# EAGLE schematic BlankMSXCartHSH (EAGLE 7.5.0)
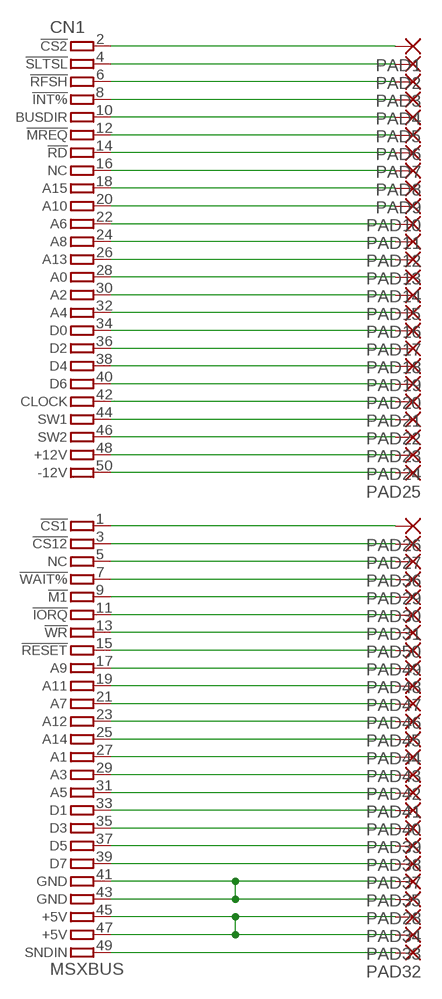
[diagram p0: schematic, sheet 1]

## Parts
CN1  MSXBUS  MSXBUS_EDGE  [MSXBUS_EDGECONN]
PAD1  1,6/0,8  [1,6/0,8]
PAD2  1,6/0,8  [1,6/0,8]
PAD3  1,6/0,8  [1,6/0,8]
PAD4  1,6/0,8  [1,6/0,8]
PAD5  1,6/0,8  [1,6/0,8]
PAD6  1,6/0,8  [1,6/0,8]
PAD7  1,6/0,8  [1,6/0,8]
PAD8  1,6/0,8  [1,6/0,8]
PAD9  1,6/0,8  [1,6/0,8]
PAD10  1,6/0,8  [1,6/0,8]
PAD11  1,6/0,8  [1,6/0,8]
PAD12  1,6/0,8  [1,6/0,8]
PAD13  1,6/0,8  [1,6/0,8]
PAD14  1,6/0,8  [1,6/0,8]
PAD15  1,6/0,8  [1,6/0,8]
PAD16  1,6/0,8  [1,6/0,8]
PAD17  1,6/0,8  [1,6/0,8]
PAD18  1,6/0,8  [1,6/0,8]
PAD19  1,6/0,8  [1,6/0,8]
PAD20  1,6/0,8  [1,6/0,8]
PAD21  1,6/0,8  [1,6/0,8]
PAD22  1,6/0,8  [1,6/0,8]
PAD23  1,6/0,8  [1,6/0,8]
PAD24  1,6/0,8  [1,6/0,8]
PAD25  1,6/0,8  [1,6/0,8]
PAD26  1,6/0,8  [1,6/0,8]
PAD27  1,6/0,8  [1,6/0,8]
PAD28  1,6/0,8  [1,6/0,8]
PAD29  1,6/0,8  [1,6/0,8]
PAD30  1,6/0,8  [1,6/0,8]
PAD31  1,6/0,8  [1,6/0,8]
PAD32  1,6/0,8  [1,6/0,8]
PAD33  1,6/0,8  [1,6/0,8]
PAD34  1,6/0,8  [1,6/0,8]
PAD35  1,6/0,8  [1,6/0,8]
PAD36  1,6/0,8  [1,6/0,8]
PAD37  1,6/0,8  [1,6/0,8]
PAD38  1,6/0,8  [1,6/0,8]
PAD39  1,6/0,8  [1,6/0,8]
PAD40  1,6/0,8  [1,6/0,8]
PAD41  1,6/0,8  [1,6/0,8]
PAD42  1,6/0,8  [1,6/0,8]
PAD43  1,6/0,8  [1,6/0,8]
PAD44  1,6/0,8  [1,6/0,8]
PAD45  1,6/0,8  [1,6/0,8]
PAD46  1,6/0,8  [1,6/0,8]
PAD47  1,6/0,8  [1,6/0,8]
PAD48  1,6/0,8  [1,6/0,8]
PAD49  1,6/0,8  [1,6/0,8]
PAD50  1,6/0,8  [1,6/0,8]

## Nets
+5V: CN1.45(45.+5V) CN1.47(47.+5V) PAD33.1(P) PAD34.1(P)
GND: CN1.41(41.GND) CN1.43(43.GND) PAD28.1(P) PAD35.1(P)
N$1: CN1.2(2.!CS2) PAD1.1(P)
N$2: CN1.4(4.!SLTSL) PAD2.1(P)
N$4: CN1.6(6.!RFSH) PAD3.1(P)
N$6: CN1.8(8.!INT%) PAD4.1(P)
N$7: CN1.10(10.BUSDIR) PAD5.1(P)
N$8: CN1.12(12.!MREQ) PAD6.1(P)
N$9: CN1.14(14.!RD) PAD7.1(P)
N$10: CN1.16(16.NC) PAD8.1(P)
N$11: CN1.18(18.A15) PAD9.1(P)
N$12: CN1.20(20.A10) PAD10.1(P)
N$13: CN1.22(22.A6) PAD11.1(P)
N$14: CN1.24(24.A8) PAD12.1(P)
N$15: CN1.26(26.A13) PAD13.1(P)
N$16: CN1.28(28.A0) PAD14.1(P)
N$17: CN1.30(30.A2) PAD15.1(P)
N$18: CN1.32(32.A4) PAD16.1(P)
N$19: CN1.34(34.D0) PAD17.1(P)
N$20: CN1.36(36.D2) PAD18.1(P)
N$21: CN1.38(38.D4) PAD19.1(P)
N$22: CN1.40(40.D6) PAD20.1(P)
N$23: CN1.42(42.CLOCK) PAD21.1(P)
N$24: CN1.44(44.SW1) PAD22.1(P)
N$25: CN1.46(46.SW2) PAD23.1(P)
N$26: CN1.48(48.+12V) PAD24.1(P)
N$27: CN1.50(50.-12V) PAD25.1(P)
N$28: CN1.1(1.!CS1) PAD26.1(P)
N$29: CN1.3(3.!CS12) PAD27.1(P)
N$30: CN1.5(5.NC) PAD36.1(P)
N$31: CN1.7(7.!WAIT%) PAD29.1(P)
N$32: CN1.9(9.!M1) PAD30.1(P)
N$33: CN1.11(11.!IORQ) PAD31.1(P)
N$34: CN1.49(49.SNDIN) PAD32.1(P)
N$39: CN1.39(39.D7) PAD37.1(P)
N$40: CN1.37(37.D5) PAD38.1(P)
N$41: CN1.35(35.D3) PAD39.1(P)
N$42: CN1.33(33.D1) PAD40.1(P)
N$43: CN1.31(31.A5) PAD41.1(P)
N$44: CN1.29(29.A3) PAD42.1(P)
N$45: CN1.27(27.A1) PAD43.1(P)
N$46: CN1.25(25.A14) PAD44.1(P)
N$47: CN1.23(23.A12) PAD45.1(P)
N$48: CN1.21(21.A7) PAD46.1(P)
N$49: CN1.19(19.A11) PAD47.1(P)
N$302: CN1.17(17.A9) PAD48.1(P)
N$303: CN1.15(15.!RESET) PAD49.1(P)
N$304: CN1.13(13.!WR) PAD50.1(P)

## Library data of the parts
CN1 = msx_breadboards:MSXBUS_EDGE: MSX bus (50 pin) edge connector Created 2013 by Eugeny Brychkov
PAD1-PAD50 = wirepad:1,6/0,8: THROUGH-HOLE PAD